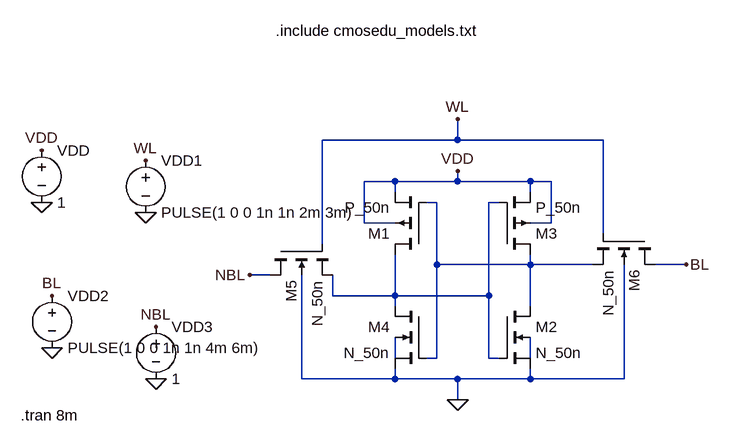
[diagram p0: schematic sram6t.asc]
sram6t.asc, the LTspice schematic file:
Version 4.1
SHEET 1 880 680
WIRE 176 -32 176 -64
WIRE 176 -32 -32 -32
WIRE 400 -32 176 -32
WIRE 80 32 32 32
WIRE 176 32 176 16
WIRE 176 32 80 32
WIRE 288 32 176 32
WIRE 320 32 288 32
WIRE 80 48 80 32
WIRE 288 48 288 32
WIRE 144 64 128 64
WIRE 240 64 224 64
WIRE 32 96 32 32
WIRE 80 96 32 96
WIRE 320 96 320 32
WIRE 320 96 288 96
WIRE 400 112 400 -32
WIRE -32 128 -32 -32
WIRE 144 160 144 64
WIRE 288 160 288 144
WIRE 288 160 144 160
WIRE 384 160 288 160
WIRE 528 160 480 160
WIRE -112 176 -144 176
WIRE -16 208 -16 176
WIRE 80 208 80 144
WIRE 80 208 -16 208
WIRE 224 208 224 64
WIRE 224 208 80 208
WIRE 80 224 80 208
WIRE 288 224 288 160
WIRE 80 304 80 272
WIRE 144 304 144 160
WIRE 144 304 128 304
WIRE 224 304 224 208
WIRE 240 304 224 304
WIRE 288 304 288 272
WIRE -64 336 -64 176
WIRE 80 336 80 320
WIRE 80 336 -64 336
WIRE 176 336 80 336
WIRE 288 336 288 320
WIRE 288 336 176 336
WIRE 432 336 432 160
WIRE 432 336 288 336
WIRE 176 368 176 336
FLAG 176 368 0
FLAG 176 -64 WL
FLAG 176 16 VDD
FLAG -464 64 0
FLAG -464 -16 VDD
FLAG -304 80 0
FLAG -304 0 WL
FLAG -448 288 0
FLAG -448 208 BL
FLAG -288 336 0
FLAG 528 160 BL
FLAG -144 176 NBL
FLAG -288 256 NBL
SYMBOL pmos4 128 144 R180
SYMATTR InstName M1
SYMATTR Value P_50n
SYMBOL nmos4 240 224 R0
SYMATTR InstName M2
SYMATTR Value N_50n
SYMBOL pmos4 240 144 M180
SYMATTR InstName M3
SYMATTR Value P_50n
SYMBOL nmos4 128 224 M0
SYMATTR InstName M4
SYMATTR Value N_50n
SYMBOL nmos4 -112 128 M90
SYMATTR InstName M5
SYMATTR Value N_50n
SYMBOL nmos4 480 112 R90
SYMATTR InstName M6
SYMATTR Value N_50n
SYMBOL voltage -464 -32 R0
WINDOW 123 0 0 Left 0
WINDOW 39 0 0 Left 0
SYMATTR InstName VDD
SYMATTR Value 1
SYMBOL voltage -304 -16 R0
WINDOW 123 0 0 Left 0
WINDOW 39 0 0 Left 0
SYMATTR InstName VDD1
SYMATTR Value PULSE(1 0 0 1n 1n 2m 3m)
SYMBOL voltage -448 192 R0
WINDOW 123 0 0 Left 0
WINDOW 39 0 0 Left 0
SYMATTR InstName VDD2
SYMATTR Value PULSE(1 0 0 1n 1n 4m 6m)
SYMBOL voltage -288 240 R0
WINDOW 123 0 0 Left 0
WINDOW 39 0 0 Left 0
SYMATTR InstName VDD3
SYMATTR Value 1
TEXT -496 392 Left 2 !.tran 8m
TEXT -104 -200 Left 2 !.include cmosedu_models.txt

The netlist it stands for:
* sram6t.asc
M1 N002 N001 VDD VDD P_50n
M2 N001 N002 0 N004 N_50n
M3 N001 N002 VDD VDD P_50n
M4 N002 N001 0 N003 N_50n
M5 NBL WL N002 0 N_50n
M6 BL WL N001 0 N_50n
VDD VDD 0 1
VDD1 WL 0 PULSE(1 0 0 1n 1n 2m 3m)
VDD2 BL 0 PULSE(1 0 0 1n 1n 4m 6m)
VDD3 NBL 0 1
.model NMOS NMOS
.model PMOS PMOS
.lib standard.mos
.tran 8m
.include cmosedu_models.txt
.backanno
.end